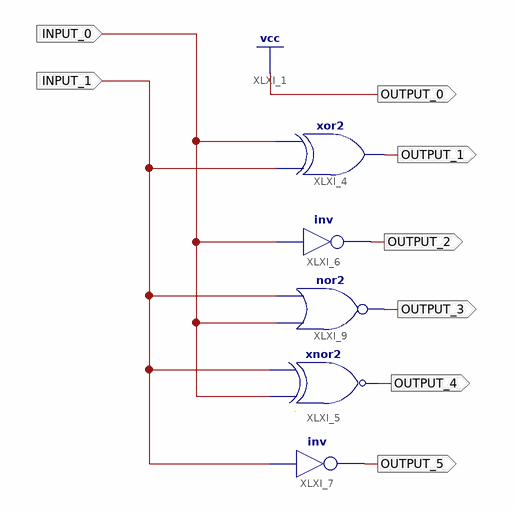
[diagram p0: schematic sheet 1]
// Xilinx ISE schematic SCHEME.sch (spartan3a) as structural Verilog: 5 symbols, 8 ports
module SCHEME (
  input  INPUT_0,
  input  INPUT_1,
  output OUTPUT_0,
  output OUTPUT_1,
  output OUTPUT_2,
  output OUTPUT_3,
  output OUTPUT_4,
  output OUTPUT_5
);

  xor XLXI_4 (OUTPUT_1, INPUT_1, INPUT_0);
  xnor XLXI_5 (OUTPUT_4, INPUT_0, INPUT_1);
  not XLXI_6 (OUTPUT_2, INPUT_0);
  not XLXI_7 (OUTPUT_5, INPUT_1);
  nor XLXI_9 (OUTPUT_3, INPUT_0, INPUT_1);

  assign OUTPUT_0 = 1'b1;
endmodule
